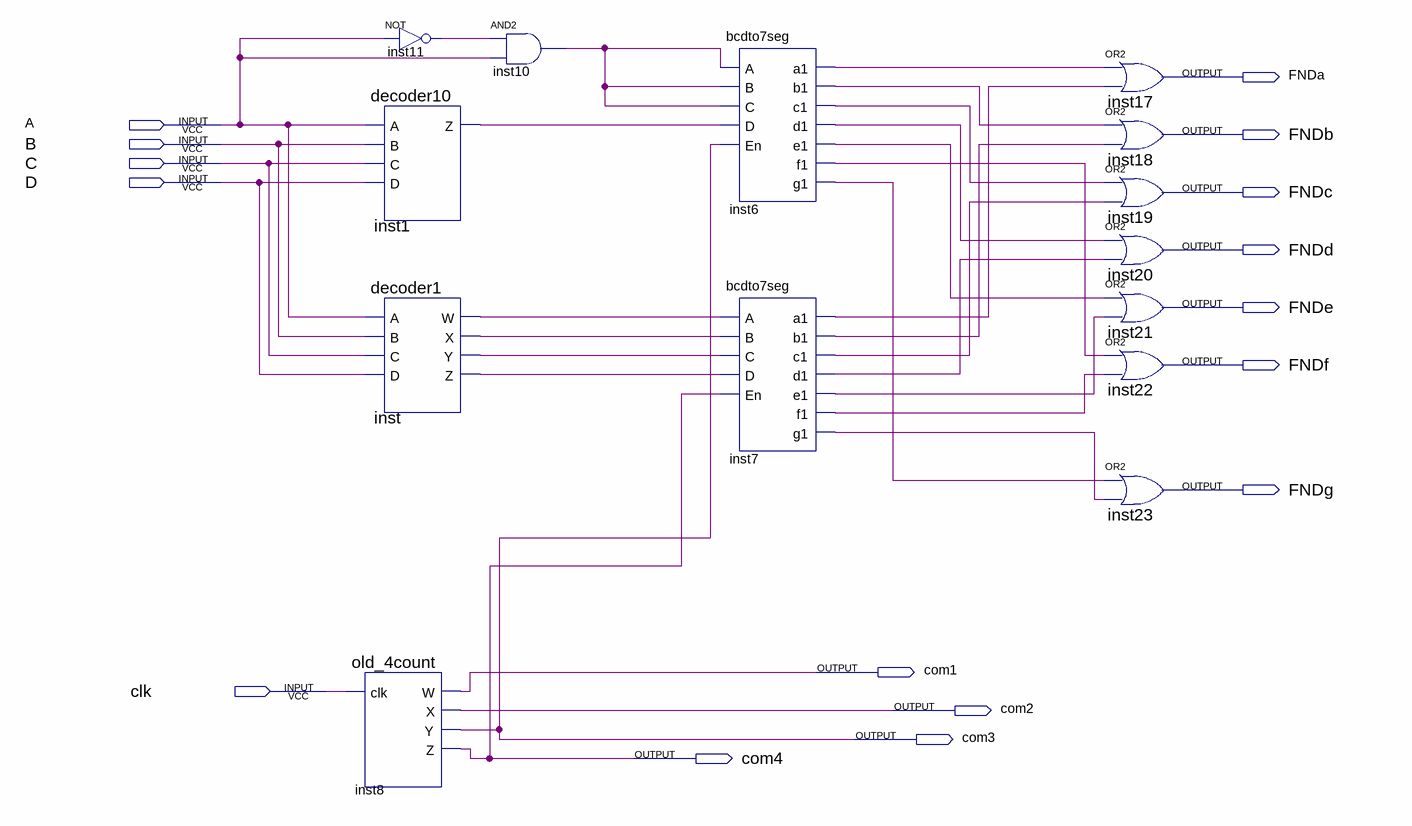
[diagram p0: schematic sheet]
// Quartus schematic FNDArray015.bdf as structural Verilog: 14 symbols, 16 pins
module FNDArray015 (
  input  A,
  input  B,
  input  C,
  input  D,
  input  clk,
  output FNDa,
  output FNDb,
  output FNDc,
  output FNDd,
  output FNDe,
  output FNDf,
  output FNDg,
  output com1,
  output com2,
  output com3,
  output com4
);

  wire inst1_z, inst6_a1, inst6_b1, inst6_c1, inst6_d1, inst6_e1, inst6_f1, inst6_g1, inst7_a1, inst7_b1,
       inst7_c1, inst7_d1, inst7_e1, inst7_f1, inst7_g1, inst10_out, inst11_out, inst_w, inst_x, inst_y,
       inst_z;

  old_4count inst8 (.clk(clk), .W(com1), .X(com2), .Y(com3), .Z(com4));
  not inst11 (inst11_out, A);
  decoder10 inst1 (.A(A), .B(B), .C(C), .D(D), .Z(inst1_z));
  decoder1 inst (.A(A), .B(B), .C(C), .D(D), .W(inst_w), .X(inst_x), .Y(inst_y), .Z(inst_z));
  and inst10 (inst10_out, inst11_out, A);
  bcdto7seg inst6 (
    .A(inst10_out), .B(inst10_out), .C(inst10_out), .D(inst1_z), .En(com3), .a1(inst6_a1), .b1(inst6_b1),
    .c1(inst6_c1), .d1(inst6_d1), .e1(inst6_e1), .f1(inst6_f1), .g1(inst6_g1));
  bcdto7seg inst7 (
    .A(inst_w), .B(inst_x), .C(inst_y), .D(inst_z), .En(com4), .a1(inst7_a1), .b1(inst7_b1), .c1(inst7_c1),
    .d1(inst7_d1), .e1(inst7_e1), .f1(inst7_f1), .g1(inst7_g1));
  or inst17 (FNDa, inst6_a1, inst7_a1);
  or inst18 (FNDb, inst6_b1, inst7_b1);
  or inst19 (FNDc, inst6_c1, inst7_c1);
  or inst20 (FNDd, inst6_d1, inst7_d1);
  or inst21 (FNDe, inst6_e1, inst7_e1);
  or inst22 (FNDf, inst6_f1, inst7_f1);
  or inst23 (FNDg, inst6_g1, inst7_g1);
endmodule
